# EAGLE design board (EAGLE 6.5.0)
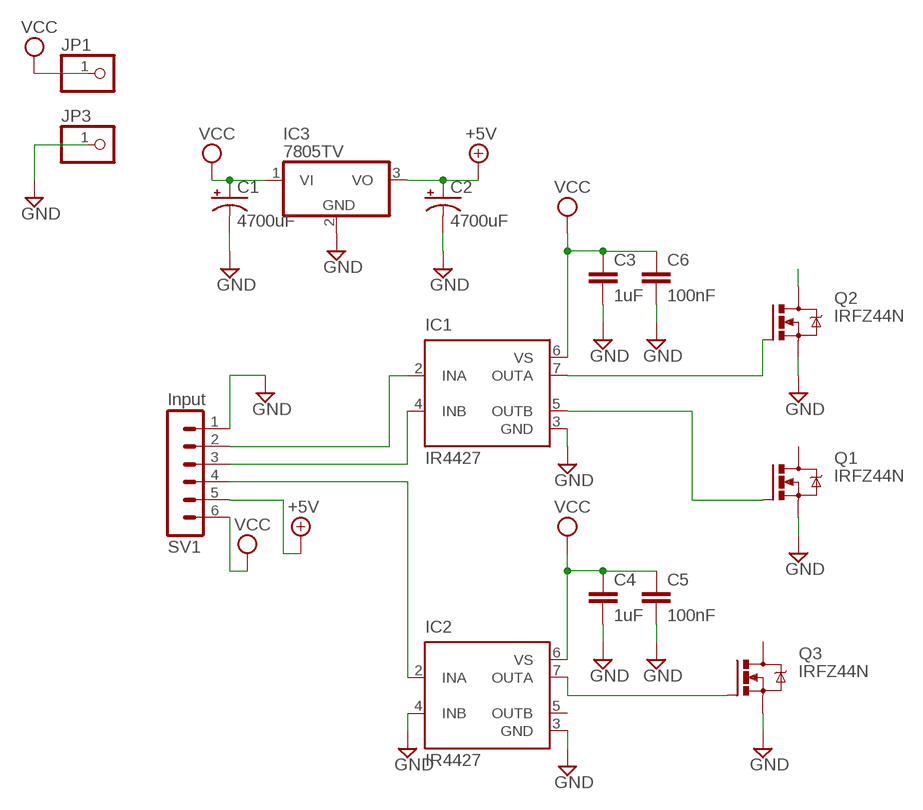
[diagram p0: schematic, sheet 1]

## Parts
C1  4700uF  CPOL-USE7.5-18  [E7,5-18]
C2  4700uF  CPOL-USE7.5-18  [E7,5-18]
C3  1uF  C-EU050-050X075  [C050-050X075]
C4  1uF  C-EU050-050X075  [C050-050X075]
C5  100nF  C-EU050-024X044  [C050-024X044]
C6  100nF  C-EU050-024X044  [C050-024X044]
IC1  IR4427  [DIL08]
IC2  IR4427  [DIL08]
IC3  7805TV  [TO220V]
JP1  PINHD-1X1  [1X01]
JP3  PINHD-1X1  [1X01]
Q1  IRFZ44N  IRF540  [TO220BV]
Q2  IRFZ44N  IRF540  [TO220BV]
Q3  IRFZ44N  IRF540  [TO220BV]
SV1  Input  MA06-1  [MA06-1]

## Nets
+5V: C2.+ IC3.3(VO) SV1.5
GND: C1.- C2.- C3.2 C4.2 C5.2 C6.2 IC1.3(GND) IC2.3(GND) IC2.4(INB) IC3.2(GND) JP3.1 Q1.S Q2.S Q3.S SV1.1
N$1: IC1.5(OUTB) Q1.G
N$2: IC1.7(OUTA) Q2.G
N$3: IC2.7(OUTA) Q3.G
N$4: IC1.4(INB) SV1.3
N$5: IC1.2(INA) SV1.2
N$6: IC2.2(INA) SV1.4
N$7: Q2.D
VCC: C1.+ C3.1 C4.1 C5.1 C6.1 IC1.6(VS) IC2.6(VS) IC3.1(VI) JP1.1 SV1.6
Unconnected: IC2.5(OUTB) Q1.D Q3.D

## Library data of the parts
C1 C2 = resistor:CPOL-US: POLARIZED CAPACITOR, American symbol
C3-C6 = resistor:C-EU: CAPACITOR, European symbol
IC1 IC2 = ir:IR4427: DUAL LOW SIDE DRIVER Source: ID4426.pdf; MF: INTERNATIONAL RECTIFIER(IR); MPN: IR4427; OC_FARNELL: 1023267; OC_NEWARK: 27C6914
IC3 = linear:78*: Positive VOLTAGE REGULATOR Source: http://cache.national.com/ds/LM/LM78L05.pdf http://www.fairchildsemi.com/ds/LM/LM7805.pdf
JP1 JP3 = pinhead:PINHD-1X1: PIN HEADER
Q1-Q3 = transistor-power:IRF540: HEXFET Power MOSFET
SV1 = con-lstb:MA06-1: PIN HEADER; OC_FARNELL: unknown; OC_NEWARK: unknown

## Board
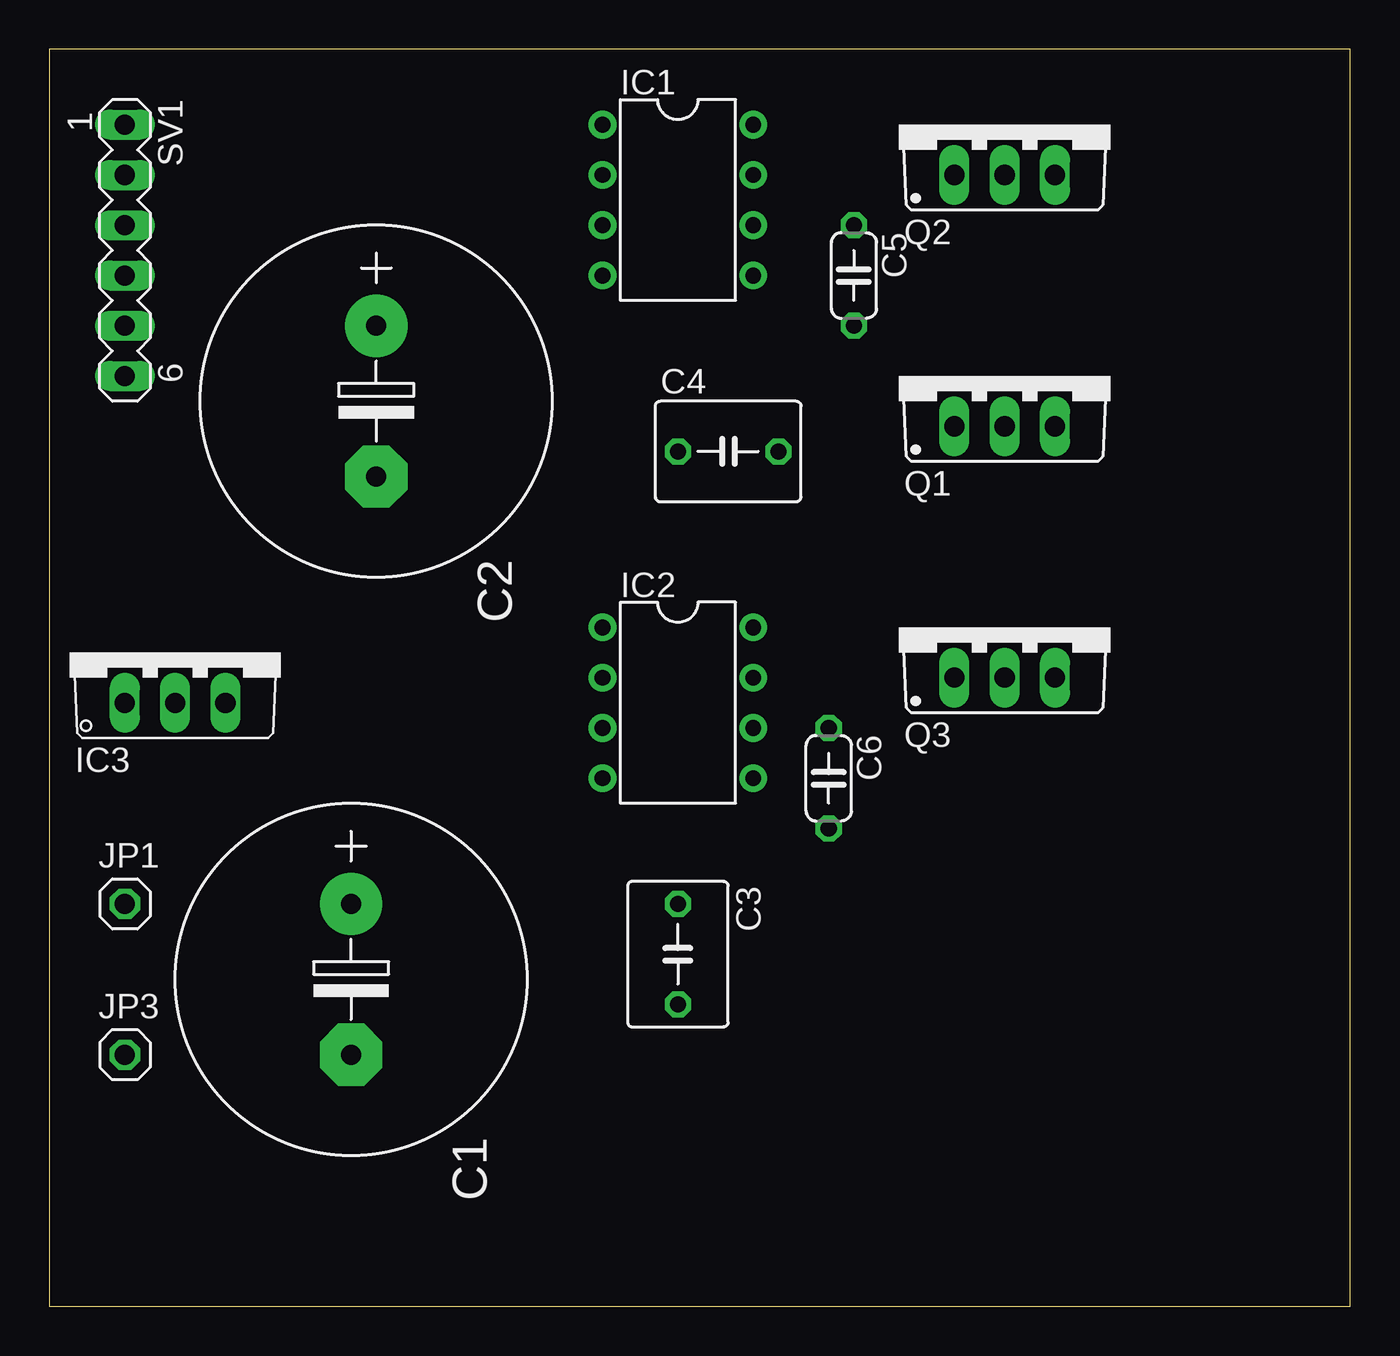
[diagram p1: board, top side]
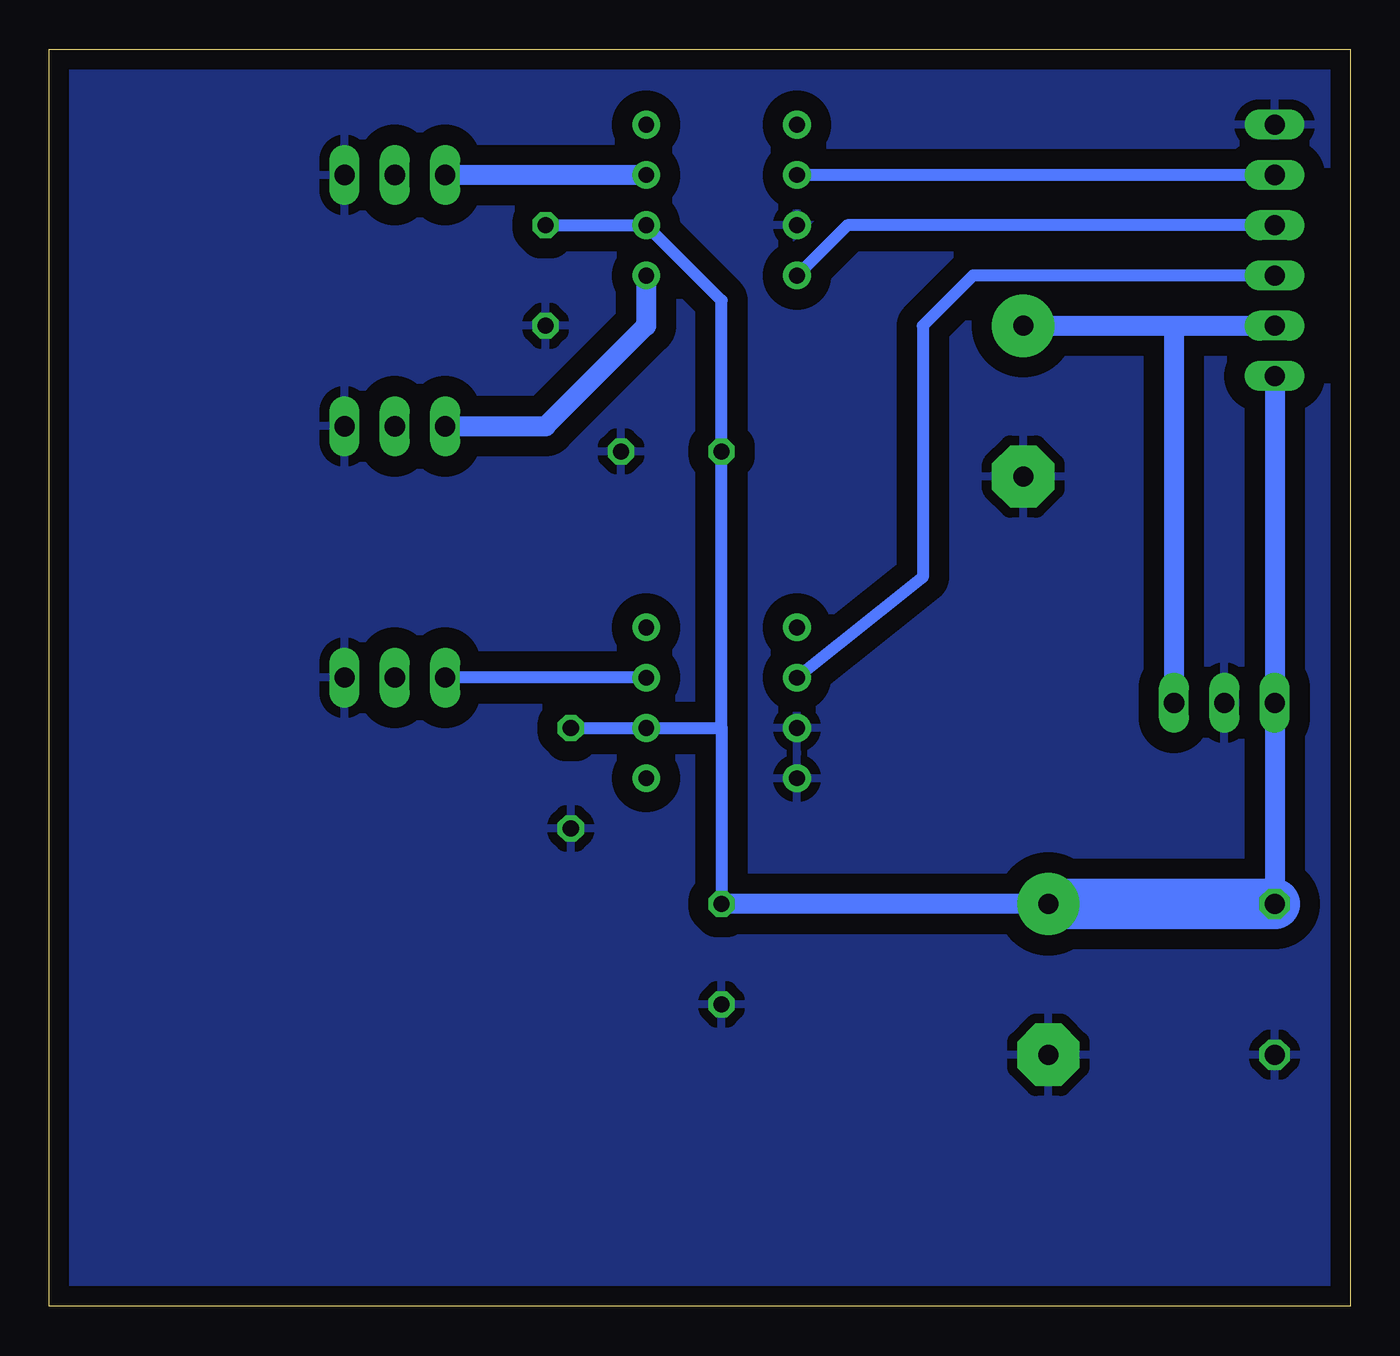
[diagram p2: board, bottom side, seen from below]

Size 65.71 x 63.49 mm. Coordinates in mm from the lower left corner, seen from the top.
Outline: 0,0 65.71,0 65.71,63.49 0,63.49 0,0
Copper layers (1*16): Top 0.035mm / dielectric 1.5mm / Bottom 0.035mm
Design rules "default *": minimum track width 10mil, minimum drill 24mil, track to track 8mil, track to pad 8mil, pad to pad 8mil, via to via 8mil, smd to smd 8mil, copper to edge 40mil, drill to drill 8mil, minimum pad ring 10mil, minimum via ring 8mil, stop-mask expansion 4mil, vias tented up to drill 0mil, thermal gap 20mil

### Footprints (pad centres in the part's own frame; a part is rotated, then mirrored left to right if it is on the bottom)
E7,5-18 = drill 1.016 pad 3.15: + -3.81,0 | drill 1.016 pad 3.15 octagon: - 3.81,0
C050-050X075 = drill 0.813 octagon: 1 -2.54,0; 2 2.54,0
C050-024X044 = drill 0.813 octagon: 1 -2.54,0; 2 2.54,0
DIL08 = drill 0.8 pad 1.4: 1 -3.81,-3.81; 2 -1.27,-3.81; 3 1.27,-3.81; 4 3.81,-3.81; 5 3.81,3.81; 6 1.27,3.81; 7 -1.27,3.81; 8 -3.81,3.81
TO220V = drill 1.016 long: 1 -2.54,-2.54; 2 0,-2.54; 3 2.54,-2.54
1X01 = drill 1.016 octagon: 1 0,0
TO220BV = drill 1.016 long: D 0,-2.54; G -2.54,-2.54; S 2.54,-2.54
MA06-1 = drill 1.016 long: 1 -6.35,0; 2 -3.81,0; 3 -1.27,0; 4 1.27,0; 5 3.81,0; 6 6.35,0

### Placement (x,y rotation side)
C1  15.24,16.51 270 top
C2  16.51,45.72 270 top
C3  31.75,17.78 270 top
C4  34.29,43.18 0 top
C5  40.64,52.07 270 top
C6  39.37,26.67 270 top
IC1  31.75,55.88 270 top
IC2  31.75,30.48 270 top
IC3  6.35,33.02 0 top
JP1  3.81,20.32 0 top
JP3  3.81,12.7 0 top
Q1  48.26,46.99 0 top
Q2  48.26,59.69 0 top
Q3  48.26,34.29 0 top
SV1  3.81,53.34 270 top

### Tracks (layer width: path | path; a pad name or v marks a point on that pad's centre or on a via)
+5V
  Bottom 1.016: 8.89,49.53 SV1.5 | C2.+ 8.89,49.53 | 8.89,49.53 IC3.3
GND
  pour Bottom (isolate 1.016): 0,63.5 66.04,63.5 66.04,-11.43 0,-11.43
N$1
  Bottom 1.016: IC1.5 35.56,49.53 40.64,44.45 Q1.G
N$2
  Bottom 1.016: IC1.7 Q2.G
N$3
  Bottom 0.61: IC2.7 Q3.G
N$4
  Bottom 0.61: SV1.3 25.4,54.61 IC1.4
N$5
  Bottom 0.61: SV1.2 IC1.2
N$6
  Bottom 0.61: SV1.4 19.05,52.07 21.59,49.53 21.59,36.83 IC2.2
VCC
  Bottom 0.61: 31.75,29.21 C4.1 31.75,50.8 IC1.6 C5.1 | 31.75,29.21 IC2.6 C6.1 | 31.75,29.21 C3.1
  Bottom 1.016: SV1.6 IC3.1 JP1.1 | C1.+ C3.1
  Bottom 2.54: JP1.1 C1.+